# EAGLE design VentaConnected_Arduino_V0.01_2017-10-27 (EAGLE 8.3.2)
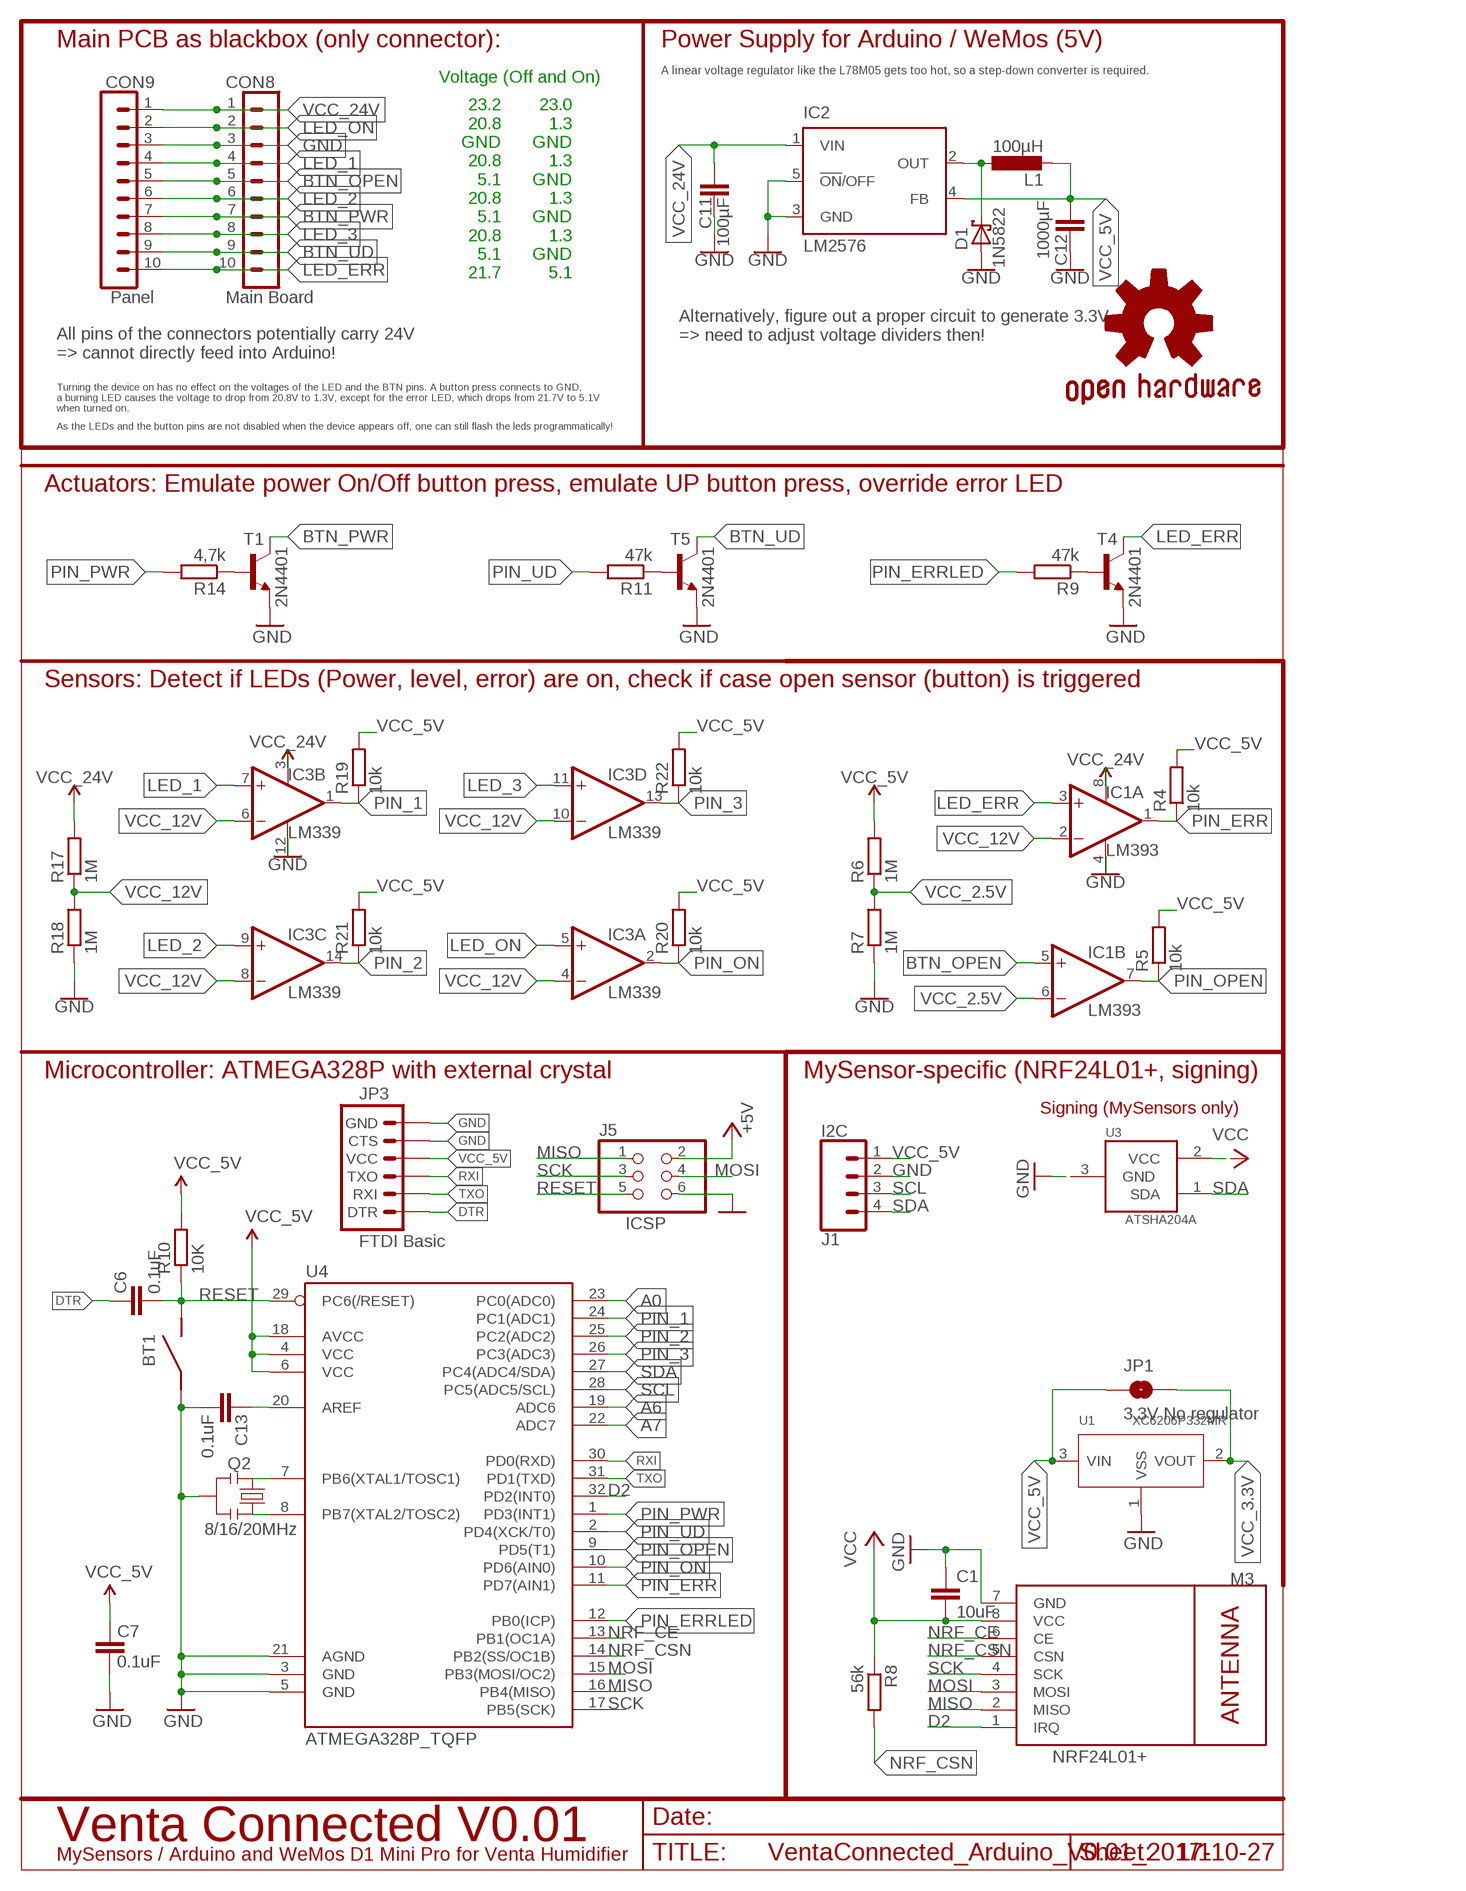
[diagram p0: schematic, sheet 1]

## Parts
BT1  SWITCHPROMINI_RESET  [SWITCH_SMD_PROMINI_RESET]
C1  10uF  C-EUC0805  [C0805]
C6  0.1uF  CAP0603-CAP  [0603-CAP]
C7  0.1uF  CAP0603-CAP  [0603-CAP]
C11  100µF  C-EUC0805  [C0805]
C12  1000µF  C-EUC0805  [C0805]
C13  0.1uF  CAP0603-CAP  [0603-CAP]
CON8  Main Board  CONN_05X2PTH  [2X5]
CON9  Panel  CONN_05X2SHD  [2X5-SHROUDED]
D1  1N5822  SCHOTTKY-DIODESMD  [SMB]
GOLD_ORB_SM1  OSHWLOGO_GOLD_ORB_SM  [OSHW2]
IC1  LM393  LM393D  [SO08]
IC2  LM2576  LM2596S  [TO263-5]
IC3  LM339  TLC339D  [SO14]
J1  I2C  CONN_04  [1X04]
J5  PINHD-2X3  [2X03]
JP1  3.3V No regulator  JUMPER-SMT_2_NO_SILK  [SMT-JUMPER_2_NO_SILK]
JP3  FTDI Basic  ARDUINO_SERIAL_PROGRAMPTH  [1X06]
L1  100µH  L-EUWE-TPC  [POWER-CHOKE_WE-TPC]
M3  NRF24L01+  WIRELESS-NRF24L01SMD  [WIRELESS-NRF24L01-SMD]
Q2  8/16/20MHz  RESONATOR1:1  [RESONATOR-SMD-1:1]
R4  10k  R-EU_R0805  [R0805]
R5  10k  R-EU_R0805  [R0805]
R6  1M  R-EU_R0805  [R0805]
R7  1M  R-EU_R0805  [R0805]
R8  56k  R-EU_R0805  [R0805]
R9  47k  R-EU_R0805  [R0805]
R10  10K  R-EU_R0805  [R0805]
R11  47k  R-EU_R0805  [R0805]
R14  4,7k  R-EU_R0805  [R0805]
R17  1M  R-EU_R0805  [R0805]
R18  1M  R-EU_R0805  [R0805]
R19  10k  R-EU_R0805  [R0805]
R20  10k  R-EU_R0805  [R0805]
R21  10k  R-EU_R0805  [R0805]
R22  10k  R-EU_R0805  [R0805]
T1  2N4401  MMBT4401LT1-NPN-SOT23-BEC  [SOT23-BEC]
T4  2N4401  MMBT4401LT1-NPN-SOT23-BEC  [SOT23-BEC]
T5  2N4401  MMBT4401LT1-NPN-SOT23-BEC  [SOT23-BEC]
U1  XC6206P332MR  PMIC-LDO-XC6206P332MR-G(SOT23)  [SOT-23]
U3  ATSHA204A  IC_ATSHA204A_CRYPT  [SOT23-3]
U4  ATMEGA328P_TQFP  [TQFP32-08]

## Nets
A0: U4.23(PC0(ADC0))
A6: U4.19(ADC6)
A7: U4.22(ADC7)
AREF: C13.2 U4.20(AREF)
BTN_OPEN: CON8.5 CON9.5 IC1.5(B:+IN)
BTN_PWR: CON8.7 CON9.7 T1.C
BTN_UD: CON8.9 CON9.9 T5.C
D2: M3.1(IRQ) U4.32(PD2(INT0))
DTR: C6.2 JP3.1(DTR)
GND: BT1.IN C7.1 C11.2 C12.2 C13.1 CON8.3 CON9.3 D1.A IC1.4(P:V-) IC2.3(GND) IC2.5(!ON!/OFF) IC3.12(P:V-) J1.2 J5.6 JP3.5(CTS) JP3.6(GND) Q2.2 R7.1 R18.1 T1.E T4.E T5.E U4.3(GND) U4.5(GND) U4.21(AGND)
GND_ARD: C1.1 M3.7(GND) U3.3(GND) ; supply symbol labelled GND
LED_1: CON8.4 CON9.4 IC3.7(B:+IN)
LED_2: CON8.6 CON9.6 IC3.9(C:+IN)
LED_3: CON8.8 CON9.8 IC3.11(D:+IN)
LED_ERR: CON8.10 CON9.10 IC1.3(A:+IN) T4.C
LED_ON: CON8.2 CON9.2 IC3.5(A:+IN)
MISO: J5.1 M3.2(MISO) U4.16(PB4(MISO))
MOSI: J5.4 M3.3(MOSI) U4.15(PB3(MOSI/OC2))
N$1: D1.C IC2.2(OUT) L1.1
N$2: R14.1 T1.B
N$5: R9.1 T4.B
N$6: R11.1 T5.B
N$12: Q2.3 U4.8(PB7(XTAL2/TOSC2))
N$13: Q2.1 U4.7(PB6(XTAL1/TOSC1))
NRF_CE: M3.6(CE) U4.13(PB1(OC1A))
NRF_CSN: M3.5(CSN) R8.2 U4.14(PB2(SS/OC1B))
PIN_1: IC3.1(B:OUT) R19.1 U4.24(PC1(ADC1))
PIN_2: IC3.14(C:OUT) R21.1 U4.25(PC2(ADC2))
PIN_3: IC3.13(D:OUT) R22.1 U4.26(PC3(ADC3))
PIN_ERR: IC1.1(A:OUT) R4.1 U4.11(PD7(AIN1))
PIN_ERRLED: R9.2 U4.12(PB0(ICP))
PIN_ON: IC3.2(A:OUT) R20.1 U4.10(PD6(AIN0))
PIN_OPEN: IC1.7(B:OUT) R5.1 U4.9(PD5(T1))
PIN_PWR: R14.2 U4.1(PD3(INT1))
PIN_UD: R11.2 U4.2(PD4(XCK/T0))
RESET: BT1.OUT C6.1 J5.5 R10.1 U4.29(PC6(/RESET))
RXI: JP3.3(TXO) U4.30(PD0(RXD))
SCK: J5.3 M3.4(SCK) U4.17(PB5(SCK))
SCL: J1.3 U4.28(PC5(ADC5/SCL))
SDA: J1.4 U3.1(SDA) U4.27(PC4(ADC4/SDA))
TXO: JP3.2(RXI) U4.31(PD1(TXD))
VCC_2.5V: IC1.6(B:-IN) R6.1 R7.2
VCC_3.3V: C1.2 JP1.2 M3.8(VCC) R8.1 U1.2(VOUT) ; supply symbol labelled VCC
VCC_5V: C7.2 C12.1 IC2.4(FB) J1.1 J5.2 JP1.1 JP3.4(VCC) L1.2 R4.2 R5.2 R6.2 R10.2 R19.2 R20.2 R21.2 R22.2 U1.3(VIN) U3.2(VCC) U4.4(VCC) U4.6(VCC) U4.18(AVCC) ; supply symbol labelled VCC, +5V
VCC_12V: IC1.2(A:-IN) IC3.4(A:-IN) IC3.6(B:-IN) IC3.8(C:-IN) IC3.10(D:-IN) R17.1 R18.2
VCC_24V: C11.1 CON8.1 CON9.1 IC1.8(P:V+) IC2.1(VIN) IC3.3(P:V+) R17.2
VSS: U1.1(VSS) ; supply symbol labelled GND

## Notes on the sheet
- Main PCB as blackbox (only connector): | Power Supply for Arduino / WeMos (5V)
- A linear voltage regulator like the L78M05 gets too hot, so a step-down converter is required.
- Voltage (Off and On)
- 23.2
  20.8
  GND
  20.8
  5.1
  20.8
  5.1
  20.8
  5.1
  21.7
- 23.0
  1.3
  GND
  1.3
  GND
  1.3
  GND
  1.3
  GND
  5.1
- Alternatively, figure out a proper circuit to generate 3.3V 
  => need to adjust voltage dividers then!
- All pins of the connectors potentially carry 24V 
  => cannot directly feed into Arduino!
- Turning the device on has no effect on the voltages of the LED and the BTN pins. A button press connects to GND, 
  a burning LED causes the voltage to drop from 20.8V to 1.3V, except for the error LED, which drops from 21.7V to 5.1V 
  when turned on.
- As the LEDs and the button pins are not disabled when the device appears off, one can still flash the leds programmatically!
- Actuators: Emulate power On/Off button press, emulate UP button press, override error LED
- Sensors: Detect if LEDs (Power, level, error) are on, check if case open sensor (button) is triggered
- Microcontroller: ATMEGA328P with external crystal | MySensor-specific (NRF24L01+, signing)
- Signing (MySensors only)
- ICSP
- Venta Connected V0.01
- MySensors / Arduino and WeMos D1 Mini Pro for Venta Humidifier

## Library data of the parts
BT1 = NCA_Sensors:SWITCH
C1 C11 C12 = rcl:C-EU: CAPACITOR, European symbol
C6 C7 C13 = SparkFun:CAP: Capacitor Standard 0603 ceramic capacitor, and 0.1" leaded capacitor.
CON8 = opentools-connectors:CONN_05X2: Multi connection point. Often used as Generic Header-pin footprint for 0.1 inch spaced/style header connections For AVR SPI programming port, see special device with nice symbol: "AVR_SPI_PROG_5x2.dev" You can populate with any combo of single row headers, but if you'd like an exact match, check these: 2x5 AVR ICSP Male Header <https://www.sparkfun.com/products/778> (PRT-00778) 2x5 Pin Shrouded Header <https://www.sparkfun.com/products/8506> (PRT-08506) On any of the 0.1 inch spaced packages, you can populate with these: Break Away Headers - Straight <https://www.sparkfun.com/products/116> (PRT-00116) Break Away Male Headers - Right Angle <https://www.sparkfun.com/products/553> (PRT-00553) Female Headers <https://www.sparkfun.com/products/115> (PRT-00115) Break Away Headers - Machine Pin <https://www.sparkfun.com/products/117> (PRT-00117) Break Away Female Headers - Swiss Machine Pin <https://www.sparkfun.com/products/743> (PRT-00743) Special note: the shrouded connector mates well with our 5x2 ribbon cables: 2x5 Pin IDC Ribbon Cable <https://www.sparkfun.com/products/8535> (PRT-08535); PROD_ID: CONN-08499; SF_ID: PRT-0778
CON9 = opentools-connectors:CONN_05X2: Multi connection point. Often used as Generic Header-pin footprint for 0.1 inch spaced/style header connections For AVR SPI programming port, see special device with nice symbol: "AVR_SPI_PROG_5x2.dev" You can populate with any combo of single row headers, but if you'd like an exact match, check these: 2x5 AVR ICSP Male Header <https://www.sparkfun.com/products/778> (PRT-00778) 2x5 Pin Shrouded Header <https://www.sparkfun.com/products/8506> (PRT-08506) On any of the 0.1 inch spaced packages, you can populate with these: Break Away Headers - Straight <https://www.sparkfun.com/products/116> (PRT-00116) Break Away Male Headers - Right Angle <https://www.sparkfun.com/products/553> (PRT-00553) Female Headers <https://www.sparkfun.com/products/115> (PRT-00115) Break Away Headers - Machine Pin <https://www.sparkfun.com/products/117> (PRT-00117) Break Away Female Headers - Swiss Machine Pin <https://www.sparkfun.com/products/743> (PRT-00743) Special note: the shrouded connector mates well with our 5x2 ribbon cables: 2x5 Pin IDC Ribbon Cable <https://www.sparkfun.com/products/8535> (PRT-08535); PROD_ID: CONN-08671; SF_ID: PRT-08506
D1 = diode:SCHOTTKY-DIODE: Schottky Diode
GOLD_ORB_SM1 = bfl:OSHWLOGO: These are Open-Source Hardware logos.
IC1 = linear:LM393: COMPARATOR
IC2 = national-semiconductor:LM2596: SIMPLE SWITCHER® Power Converter 150 kHz 3A Step-Down Voltage Regulator Source: http://www.national.com/ds/LM/LM2596.pdf; MF: NATIONAL SEMICONDUCTOR; MPN: LM2596S-ADJ/NOPB; OC_FARNELL: 9494367; OC_NEWARK: 41K3842
IC3 = linear:TLC339: COMPARATOR
J1 = SparkFun-Connectors:CONN_04: Multi connection point. Often used as Generic Header-pin footprint for 0.1 inch spaced/style header connections On any of the 0.1 inch spaced packages, you can populate with these: Break Away Headers - Straight <https://www.sparkfun.com/products/116> (PRT-00116) Break Away Male Headers - Right Angle <https://www.sparkfun.com/products/553> (PRT-00553) Female Headers <https://www.sparkfun.com/products/115> (PRT-00115) Break Away Headers - Machine Pin <https://www.sparkfun.com/products/117> (PRT-00117) Break Away Female Headers - Swiss Machine Pin <https://www.sparkfun.com/products/743> (PRT-00743) For SCREWTERMINALS and SPRING TERMINALS visit here: Screw Terimnals on SparkFun.com <https://www.sparkfun.com/search/results?term=Screw+Terminals> (5mm/3.5mm/2.54mm spacing) This device is also useful as a general connection point to wire up your design to another part of your project. Our various solder wires solder well into these plated through hole pads. Hook-Up Wire - Assortment (Stranded, 22 AWG) <https://www.sparkfun.com/products/11375> (PRT-11375) Hook-Up Wire - Assortment (Solid Core, 22 AWG) <https://www.sparkfun.com/products/11367> (PRT-11367) View the entire wire category on our website here <https://www.sparkfun.com/categories/141> Special notes: Molex polarized connector foot print use with SKU : PRT-08231 with associated crimp pins and housings. 1MM SMD Version SKU: PRT-10208; PROD_ID: CONN-09696
J5 = analyzer:PINHD-2X3
JP1 = SparkFun-Jumpers:JUMPER-SMT_2_NO: Normally open jumper This jumper has two pads in close proximity to each other. Apply solder to close the connection. Round pads are easier to solder for beginners, but are a lot larger. SparkFun Product that uses the round pads: SparkFun EL Sequencer <https://www.sparkfun.com/products/12781>
JP3 = SparkFun:ARDUINO_SERIAL_PROGRAM
L1 = rcl:L-EU: INDUCTOR, European symbol
M3 = nrf24l01plus:WIRELESS-NRF24L01: 2.4 GHz Wireless Module based on NRF24L01 chip
Q2 = Testing:RESONATOR: Resonator Small SMD resonator. This is the itty bitty 10/20MHz resonators with built in caps. CSTCE10M0G55 and CSTCE20M0V53. Footprint for SMD has been used in SFE production for years, and does work okay. 1:1 is an attempt to get larger fillets on the sides so it will be easier to inspect these solders in our AOI machine. The pads have been minimized to match the actual metal under the resonator. To see this relation, it includes an image import of the bottom side of the component. Imported to scale on layer 200.
R4 R5 R8 R10 R19-R22 = rcl:R-EU_: RESISTOR, European symbol
R6 R7 R9 R11 R14 R17 R18 = resistor:R-EU_: RESISTOR, European symbol
T1 T4 T5 = transistor-neu-to92:*-NPN-: NPN Transistror
U1 = Seeed-IC:PMIC-LDO-XC6206P332MR-G(SOT23): 310030099; MPN: XC6206P332MR-G; VALUE: XC6206P332MR-G-SOT23
U3 = TD-MySensors:IC_ATSHA204A_CRYPT
U4 = SparkFun-IC-Microcontroller:ATMEGA328P_TQFP: Popular 328P in QFP Storefront component: ATmega328 - TQFP <https://www.sparkfun.com/products/13448> (COM-13448) Datasheet <http://www.sparkfun.com/datasheets/Components/SMD/ATMega328.pdf> SparkFun Products SparkFun RedBoard - Programmed with Arduino <https://www.sparkfun.com/products/12757> (DEV-12757) Arduino Pro Mini 328 - 5V/16MHz <https://www.sparkfun.com/products/11113> (DEV-11113) Arduino Pro Mini 328 - 3.3V/8MHz <https://www.sparkfun.com/products/11114> (DEV-11114) SparkFun OpenLog <https://www.sparkfun.com/products/13712> (DEV-13712) SparkFun MicroView - OLED Arduino Module <https://www.sparkfun.com/products/12923> (DEV-12923) SparkFun Digital Sandbox <https://www.sparkfun.com/products/12651> (DEV-12651) SparkFun PicoBoard <https://www.sparkfun.com/products/11888> (WIG-11888) Arduino Fio <https://www.sparkfun.com/products/10116> (DEV-10116) LilyPad Arduino 328 Main Board <https://www.sparkfun.com/products/13342> (DEV-13342) SparkFun RedStick <https://www.sparkfun.com/products/13741> (DEV-13741) LilyPad MP3 <https://www.sparkfun.com/products/11013> (DEV-11013) LilyPad Arduino SimpleSnap <https://www.sparkfun.com/products/10941> (DEV-10941) SparkFun Stepoko <https://www.sparkfun.com/products/13899> (ROB-13899) SparkFun Geiger Counter <https://www.sparkfun.com/products/11345> (SEN-11345) SparkFun EL Sequencer <https://www.sparkfun.com/products/12781> (COM-12781) Arduino Pro 328 - 5V/16MHz <https://www.sparkfun.com/products/10915> (DEV-10915) CryptoCape <https://www.sparkfun.com/products/12773> (DEV-12773) SparkFun IR Thermometer Evaluation Board - MLX90614 <https://www.sparkfun.com/products/10740> (SEN-10740) SparkFun RedBot Mainboard <https://www.sparkfun.com/products/12097> (ROB-12097) Arduino Pro 328 - 3.3V/8MHz <https://www.sparkfun.com/products/10914> (DEV-10914) SparkFun Block for Intel® Edison - Arduino <https://www.sparkfun.com/products/13036> (DEV-13036) SparkFun Simon Says - Surface Mount Soldering Kit <https://www.sparkfun.com/products/10935> (KIT-10935) SparkFun 7-Segment Serial Display - Red <https://www.sparkfun.com/products/11441> (COM-11441) SparkFun 7-Segment Serial Display - White <https://www.sparkfun.com/products/11629> (COM-11629) SparkFun 7-Segment Serial Display - Yellow <https://www.sparkfun.com/products/11443> (COM-11443) SparkFun 7-Segment Serial Display - Kelly Green <https://www.sparkfun.com/products/11440> (COM-11440) SparkFun 7-Segment Serial Display - Blue <https://www.sparkfun.com/products/11442> (COM-11442) SparkFun OpenSegment Serial Display - 20mm (Blue) <https://www.sparkfun.com/products/11647> (COM-11647) SparkFun OpenSegment Serial Display - 20mm (Green) <https://www.sparkfun.com/products/11646> (COM-11646) SparkFun OpenSegment Serial Display - 20mm (White) <https://www.sparkfun.com/products/11648> (COM-11648) SparkFun OpenSegment Serial Display - 20mm (Red) <https://www.sparkfun.com/products/11644> (COM-11644) SparkFun OpenSegment Serial Display - 20mm (Yellow) <https://www.sparkfun.com/products/11645> (COM-11645) SparkFun OpenSegment Shield <https://www.sparkfun.com/products/13190> (DEV-13190); PROD_ID: IC-09069

## Net classes
0 default: width 0.203 mm
1 vcc: width 0.254 mm

## Board
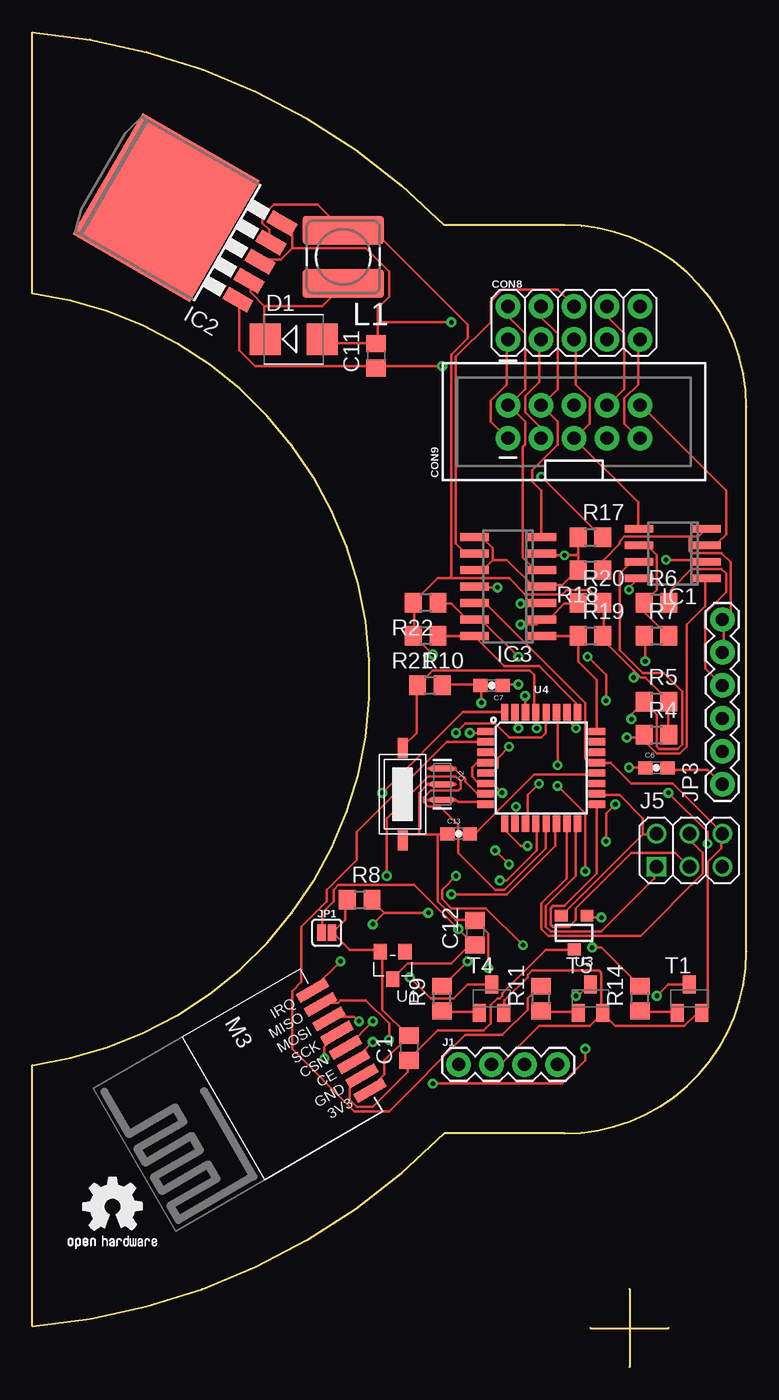
[diagram p1: board, top side]
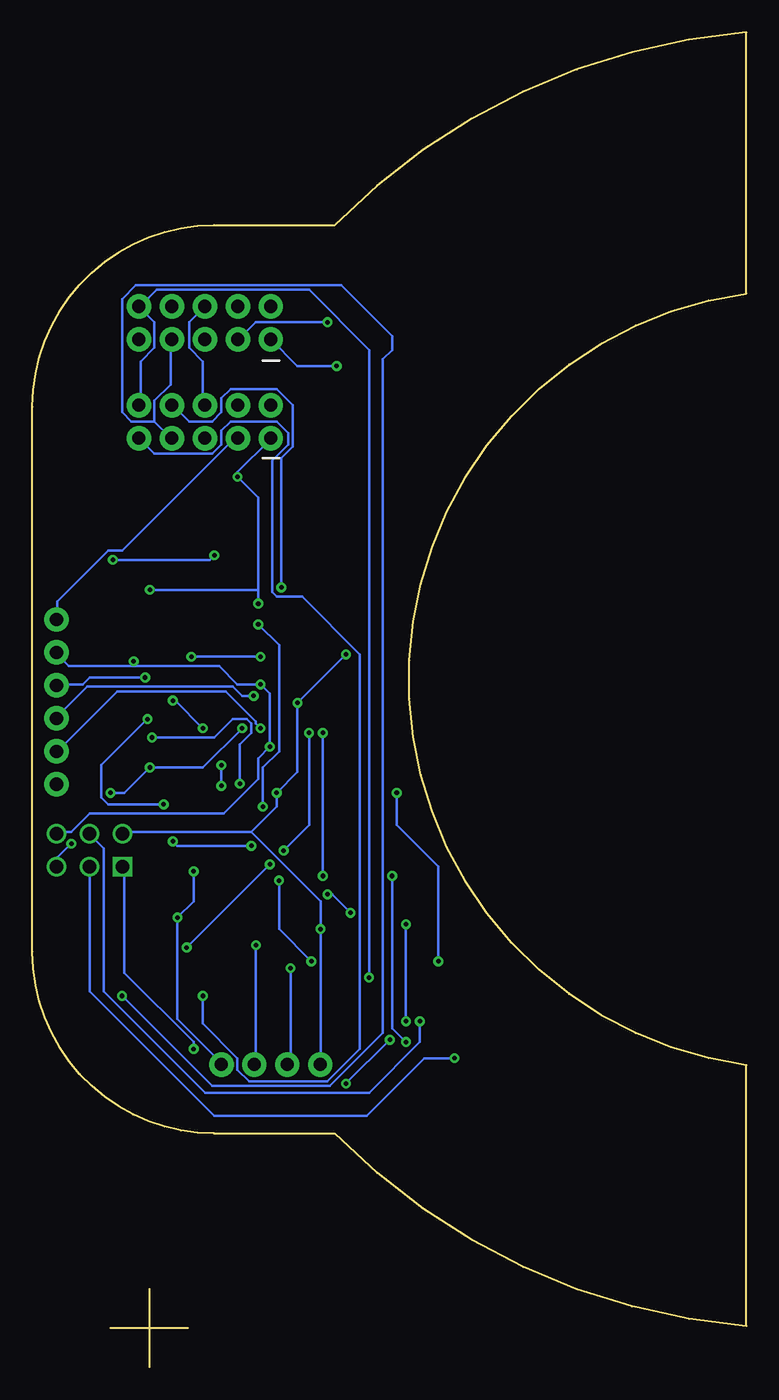
[diagram p2: board, bottom side, seen from below]

Size 55 x 102.85 mm. Coordinates in mm from the lower left corner, seen from the top.
Outline: 46,6 46,0
Outline: 43,3 49,3
Outline: 41,18 arc90 55,32 55,74 arc90 41,88 31.71,88 arc41 0,102.85 0,82.73 arc-165 0,23.27 0,3.16 arc41 31.71,18 41,18
Copper layers (1*16): Top 0.035mm / dielectric 1.5mm / Bottom 0.035mm
Design rules "default": minimum track width 6mil, minimum drill 0.35mm, track to track 6mil, track to pad 6mil, pad to pad 6mil, via to via 6mil, smd to smd 6mil, copper to edge 40mil, drill to drill 6mil, minimum pad ring 10mil, minimum via ring 8mil, stop-mask expansion 4mil, vias tented up to drill 0mil, thermal gap 10mil

### Footprints (pad centres in the part's own frame; a part is rotated, then mirrored left to right if it is on the bottom)
SWITCH_SMD_PROMINI_RESET = smd 1.524 x 0.762: IN -0.508,1.778; OUT 6.604,1.778
C0805 = smd 1.3 x 1.5: 1 -0.95,0; 2 0.95,0
0603-CAP = smd 1.1 x 1: 1 -0.85,0; 2 0.85,0
2X5 = drill 1.016 pad 1.88: 1 0,0; 2 0,2.54; 3 2.54,0; 4 2.54,2.54; 5 5.08,0; 6 5.08,2.54; 7 7.62,0; 8 7.62,2.54; 9 10.16,0; 10 10.16,2.54
2X5-SHROUDED = drill 1.016 pad 1.88: 1 -1.27,5.08; 2 1.27,5.08; 3 -1.27,2.54; 4 1.27,2.54; 5 -1.27,0; 6 1.27,0; 7 -1.27,-2.54; 8 1.27,-2.54; 9 -1.27,-5.08; 10 1.27,-5.08
SMB = smd 2.4 x 2.4: A 2.2,0; C -2.2,0
SO08 = smd 0.6 x 2.2: 1 -1.905,-2.6; 2 -0.635,-2.6; 3 0.635,-2.6; 4 1.905,-2.6; 5 1.905,2.6; 6 0.635,2.6; 7 -0.635,2.6; 8 -1.905,2.6
TO263-5 = smd 1.067 x 2.159: 1 -3.404,-5.791; 2 -1.702,-5.791; 3 0,-5.791; 4 1.702,-5.791; 5 3.404,-5.791 | smd 10.8 x 10.41: 6 0,2.54
SO14 = smd 0.6 x 2.2: 1 -3.81,-2.6; 2 -2.54,-2.6; 3 -1.27,-2.6; 4 0,-2.6; 5 1.27,-2.6; 6 2.54,-2.6; 7 3.81,-2.6; 8 3.81,2.6; 9 2.54,2.6; 10 1.27,2.6; 11 0,2.6; 12 -1.27,2.6; 13 -2.54,2.6; 14 -3.81,2.6
1X04 = drill 1.016 pad 1.88: 1 0,0; 2 2.54,0; 3 5.08,0; 4 7.62,0
2X03 = drill 1.016 square: 1 -2.54,-1.27 | drill 1.016: 2 -2.54,1.27; 3 0,-1.27; 4 0,1.27; 5 2.54,-1.27; 6 2.54,1.27
SMT-JUMPER_2_NO_SILK = smd 0.635 x 1.27: 1 -0.406,0; 2 0.406,0
1X06 = drill 1.016 pad 1.88: 1 0,0; 2 2.54,0; 3 5.08,0; 4 7.62,0; 5 10.16,0; 6 12.7,0
POWER-CHOKE_WE-TPC = smd 6.3 x 2.2: 1 0,2.05; 2 0,-2.05
WIRELESS-NRF24L01-SMD = smd 2.54 x 0.762: 1 1.27,0; 2 1.27,1.27; 3 1.27,2.54; 4 1.27,3.81; 5 1.27,5.08; 6 1.27,6.35; 7 1.27,7.62; 8 1.27,8.89
RESONATOR-SMD-1:1 = smd 0.45 x 1.905: 1 -1.2,0; 2 0,0; 3 1.2,0
R0805 = smd 1.3 x 1.5: 1 -0.95,0; 2 0.95,0
SOT23-BEC = smd 1 x 1.4: B -0.95,-1.1; C 0,1.1; E 0.95,-1.1
SOT-23 = smd 1.016 x 1.2: 1 -0.95,-1.06; 2 0.95,-1.06; 3 0,1.06
SOT23-3 = smd 1 x 0.9: 1 -1,-1.3; 2 1,-1.3; 3 0,1.3
TQFP32-08 = smd 1.27 x 0.559: 1 -4.293,2.8; 2 -4.293,2; 3 -4.293,1.2; 4 -4.293,0.4; 5 -4.293,-0.4; 6 -4.293,-1.2; 7 -4.293,-2; 8 -4.293,-2.8; 17 4.293,-2.8; 18 4.293,-2; 19 4.293,-1.2; 20 4.293,-0.4; 21 4.293,0.4; 22 4.293,1.2; 23 4.293,2; 24 4.293,2.8 | smd 0.559 x 1.27: 9 -2.8,-4.293; 10 -2,-4.293; 11 -1.2,-4.293; 12 -0.4,-4.293; 13 0.4,-4.293; 14 1.2,-4.293; 15 2,-4.293; 16 2.8,-4.293; 25 2.8,4.293; 26 2,4.293; 27 1.2,4.293; 28 0.4,4.293; 29 -0.4,4.293; 30 -1.2,4.293; 31 -2,4.293; 32 -2.8,4.293

### Placement (x,y rotation side)
BT1  30.29,41.1 90 top
C1  29.02,24.59 90 top
C6  48.07,46.18 0 top
C7  35.37,52.53 180 top
C11  26.48,77.93 90 top
C12  34.1,33.48 90 top
C13  32.83,41.1 0 top
CON8  36.64,79.2 0 top
CON9  41.72,72.85 90 top
D1  20.13,79.2 0 top
GOLD_ORB_SM1  2.35,8.08 0 top
IC1  49.34,62.69 90 top
IC2  12.51,88.09 60 top
IC3  36.64,60.15 90 top
J1  32.83,23.32 0 top
J5  50.61,39.83 0 top
JP1  22.67,33.48 0 top
JP3  53.15,44.91 90 top
L1  23.94,85.55 180 top
M3  22.67,29.67 210 top
Q2  31.56,44.91 270 top
R4  48.07,48.72 0 top
R5  48.07,51.26 0 top
R6  48.07,58.88 0 top
R7  48.07,56.34 0 top
R8  25.21,36.02 0 top
R9  31.56,28.4 90 top
R10  30.61,52.53 0 top
R11  39.18,28.4 90 top
R14  46.8,28.4 90 top
R17  42.99,63.96 0 top
R18  42.99,61.42 180 top
R19  42.99,56.34 0 top
R20  42.99,58.88 0 top
R21  30.29,56.34 180 top
R22  30.29,58.88 180 top
T1  50.61,28.4 0 top
T4  35.37,28.4 0 top
T5  42.99,28.4 0 top
U1  27.75,30.94 180 top
U3  41.72,33.48 180 top
U4  39.18,46.18 0 top

### Tracks (layer width: path | path; a pad name or v marks a point on that pad's centre or on a via)
AREF
  Top 0.203: C13.2 33.69,41.23 34.23,41.23 38.67,45.67 43.47,45.67 U4.20
BTN_OPEN
  Top 0.203: IC1.5 46.67,64.7 46.67,66.65 41.87,71.45 CON9.5 41.87,71.63 42.94,72.7 42.94,74.65 41.87,75.72 41.87,79.1 CON8.5
BTN_PWR  (via drill 0.35)
  Top 0.203: v48.09,28.6 48.98,29.49 50.59,29.49 T1.C
  Bottom 0.203: v48.09,28.6 41.16,21.67 32.09,21.67 28,25.76 28,77.68 27.29,78.39 27.29,79.45 31.2,83.37 47.03,83.37 48.09,82.3 48.09,73.59 47.38,72.88 45.61,72.88 | 45.61,72.88 44.36,71.63 CON9.7 | 45.61,72.88 45.61,74.48 44.36,75.72 44.36,79.1 CON8.7
BTN_UD  (via drill 0.35)
  Top 0.203: v41.87,28.6 42.05,28.6 42.94,29.49 T5.C | CON8.9 46.67,79.1 46.67,75.72 45.61,74.65 45.61,72.7 46.67,71.63 CON9.9
  Bottom 0.203: v41.87,28.6 41.87,26.47 39.2,23.8 39.2,22.91 38.32,22.02 32.27,22.02 29.78,24.51 29.78,54.92 34.23,59.36 36.18,59.36 36.54,59.72 36.54,69.85 35.29,71.1 35.29,71.99 36.18,72.88 39.74,72.88 40.45,72.16 40.45,71.1 41.16,70.39 45.61,70.39 CON9.9
D2  (via drill 0.35)
  Top 0.203: U4.32 33.16,50.47 v26.94,44.25 | v23.74,31.27 21.6,29.14 M3.1
  Bottom 0.203: v26.94,44.25 26.94,41.76 23.74,38.56 v23.74,31.27
DTR
  Top 0.203: C6.2 48.98,46.03 52.01,46.03 53.07,44.96 JP3.1
GND  (via drill 0.35)
  Top 0.203: IC3.12 34.05,58.83 34.94,58.83 42.58,51.18 42.58,46.92 42.76,46.74 43.47,46.74 U4.21 43.47,46.56 44.54,46.56 46.14,44.96 49.34,44.96 53.07,41.23 J5.6 53.07,41.05 53.07,39.98 52.01,38.92 52.01,27.71 51.65,27.36 T1.E 51.47,27.18 51.12,27.18 50.23,26.29 44.9,26.29 44.01,27.18 T5.E | 29.78,41.05 28.89,41.05 28.54,40.69 BT1.IN | 29.78,41.05 31.2,41.05 | 31.2,41.05 31.92,41.05 C13.1 | 31.2,41.05 31.2,35.89 32.63,34.47 34.05,34.47 C12.2 34.23,34.29 35.12,33.4 v35.12,30.74 | 29.78,41.05 29.78,44.25 30.49,44.96 30.54,44.91 | T4.E 36.36,27.36 36.36,28.25 38.14,30.03 38.14,30.2 38.49,30.56 43.65,30.56 43.83,30.38 43.83,27.36 T5.E | J1.2 35.47,23.45 36.18,23.45 39.03,26.29 42.94,26.29 43.83,27.18 T5.E | D1.A 22.49,79.1 22.67,78.92 26.4,78.92 C11.2 26.58,78.92 26.58,80.52 | 20,86.21 19.11,85.32 17.69,85.32 IC2.3 | 20,86.21 20,87.28 19.29,87.99 IC2.5 | 26.58,80.52 26.58,81.59 27.47,82.48 27.47,84.43 25.69,86.21 20,86.21 | CON9.3 39.03,71.63 39.03,72.52 37.96,73.59 37.96,74.83 39.03,75.9 39.03,79.1 CON8.3 | 50.59,63.98 51.3,63.98 51.83,64.52 IC1.4 | 50.59,63.98 45.61,63.98 45.25,63.63 45.25,63.45 44.01,62.21 44.01,61.5 R18.1 | 35.83,46.92 35.83,46.2 35.47,45.85 34.94,45.85 U4.5 | 35.83,46.92 35.47,47.27 34.94,47.27 U4.3 | v37.43,52.61 36.36,52.61 C7.1 | v47.21,54.38 47.21,56.34 R7.1 | v36.72,47.81 35.83,46.92 | JP3.5 53.25,55.09 53.25,57.59 JP3.6 53.25,57.76 53.78,58.3 53.78,62.03 53.07,62.74 50.76,62.74 50.59,62.92 50.59,63.98 | v32.27,80.52 26.58,80.52
  Bottom 0.203: v35.12,30.74 35.12,23.62 35.29,23.45 J1.2 | 47.21,54.03 52.19,54.03 53.07,54.92 JP3.5 | 47.21,54.03 40.63,54.03 39.2,52.61 v37.43,52.61 36.72,51.9 v36.72,47.81 37.6,46.92 37.6,45.32 40.27,42.65 50.59,42.65 52.01,41.23 53.07,41.23 J5.6 | 47.21,54.03 v47.21,54.38 | CON9.3 39.2,71.45 39.56,71.45 48.09,62.92 49.16,62.92 53.07,59.01 53.07,57.76 JP3.6 | v32.27,80.52 37.78,80.52 39.03,79.28 CON8.3
GND_ARD
  Top 0.203: U3.3 41.7,32.16 39.56,32.16 36.18,28.78 36.18,28.6 36.01,28.43 35.83,28.43 35.29,27.89 35.29,26.47 34.76,25.94 31.2,25.94 29.07,23.8 C1.1 28.89,23.62 28.89,22.74 26.23,20.07 24.98,20.07 24.45,20.6 24.45,21.49 25.34,22.38 M3.7
LED_1
  Top 0.203: 39.2,74.12 40.45,72.88 40.45,71.1 38.49,69.14 38.49,68.25 39.2,67.54 39.2,63.98 IC3.7 | 39.2,74.12 40.45,75.36 40.45,79.63 39.2,80.88 39.2,81.59 CON8.4 | 39.2,74.12 CON9.4
LED_2
  Top 0.203: CON8.6 40.45,83.01 36.18,83.01 35.29,82.12 35.29,80.52 32.63,77.85 32.63,63.45 33.34,62.74 33.87,62.74 IC3.9
  Bottom 0.203: CON8.6 42.94,80.52 42.94,78.56 41.87,77.5 41.87,74.12 CON9.6
LED_3  (via drill 0.35)
  Top 0.203: v35.83,60.07 34.05,60.07 IC3.11 | CON8.8 44.36,81.59 44.36,80.88 45.61,79.63 45.61,75.36 44.36,74.12 CON9.8
  Bottom 0.203: v35.83,60.07 35.83,70.03 34.94,70.92 34.94,74.12 36.18,75.36 39.74,75.36 40.45,74.65 40.45,73.59 41.16,72.88 42.94,72.88 44.18,74.12 CON9.8
LED_ERR  (via drill 0.35)
  Top 0.203: IC1.3 52.01,63.45 52.72,63.45 53.43,64.16 53.43,67.54 46.85,74.12 CON9.10 | v29.07,30.03 30.67,28.43 32.45,28.43 33.52,29.49 35.29,29.49 T4.C
  Bottom 0.203: v29.07,30.03 29.07,78.39 33.69,83.01 45.43,83.01 46.67,81.77 CON8.10 46.67,81.59 45.61,80.52 45.61,78.56 46.67,77.5 46.67,74.12 CON9.10
LED_ON
  Top 0.203: 36.72,74.12 37.96,72.88 37.96,71.1 37.78,70.92 37.78,62.38 38.67,61.5 39.2,61.5 IC3.5 | 36.72,74.12 37.96,75.36 37.96,79.63 36.72,80.88 36.72,81.59 CON8.2 | 36.72,74.12 CON9.2
MISO  (via drill 0.35)
  Top 0.203: U4.16 41.87,41.76 41.87,37.85 39.56,35.54 39.56,33.94 39.92,33.58 43.83,33.58 47.92,37.67 47.92,38.56 J5.1 | v27.47,25.23 27.47,26.47 25.69,28.25 23.74,28.25 23.56,28.07 22.31,28.07 M3.2 | v30.85,21.85 40.81,21.85 42.58,23.62 v42.58,24.51
  Bottom 0.203: v30.85,21.85 v27.47,25.23 | v42.58,24.51 42.58,25.05 47.92,30.38 47.92,38.56 J5.1
MOSI  (via drill 0.35)
  Top 0.203: U4.15 41.16,41.76 41.16,37.67 39.2,35.72 39.2,33.76 39.74,33.23 46.85,33.23 51.65,38.03 51.65,39.63 50.76,40.52 50.76,41.05 J5.4 | v25.16,26.65 24.8,27 22.85,27 M3.3
  Bottom 0.203: v25.16,26.65 25.16,25.05 29.07,21.14 41.7,21.14 49.52,28.96 49.52,39.98 50.59,41.05 J5.4
N$1
  Top 0.203: 17.87,81.77 16.8,82.83 16.8,83.54 IC2.2 | 17.87,81.77 17.87,79.28 D1.C | 17.87,81.77 22.31,81.77 23.91,83.37 L1.1
N$2
  Top 0.203: T1.B 49.52,27.36 46.85,27.36 R14.1
N$5
  Top 0.203: T4.B 34.41,27.36 31.56,27.36 R9.1
N$6
  Top 0.203: T5.B 41.87,27.36 39.2,27.36 R11.1
N$12
  Top 0.203: U4.8 34.76,43.54 32.8,43.54 32.63,43.72 Q2.3
N$13
  Top 0.203: U4.7 34.76,44.25 34.23,44.25 33.34,45.14 33.34,45.32 32.63,46.03 Q2.1
NRF_CE  (via drill 0.35)
  Top 0.203: v27.29,37.85 27.29,42.29 30.49,45.49 32.63,45.49 32.98,45.14 32.98,44.6 32.8,44.43 30.67,44.43 30.14,43.89 30.14,43.54 30.49,43.18 31.38,43.18 32.8,41.76 32.8,39.63 35.65,36.78 36.36,36.78 39.56,39.98 39.56,41.76 U4.13 | v26.23,25.05 24.8,23.62 M3.6
  Bottom 0.203: v27.29,37.85 27.29,26.11 v26.23,25.05
NRF_CSN  (via drill 0.35)
  Top 0.152: 24.25,24.75 M3.5
  Top 0.203: v32.27,36.43 36.54,36.43 40.27,40.16 40.27,41.76 U4.14 | 27.11,35 v30.49,35 | 27.11,35 26.23,35.89 R8.2 | v26.23,26.65 24.27,24.69 M3.5 | 27.11,35 v26.23,34.11
  Bottom 0.203: v32.27,36.43 31.92,36.43 v30.49,35 | v26.23,34.11 v26.23,26.65
PIN_1
  Top 0.203: U4.24 43.47,52.96 42.05,54.38 R19.1 IC3.1
PIN_2
  Top 0.203: U4.25 41.87,50.47 41.87,51.18 39.03,54.03 36.36,54.03 IC3.14 R21.1
PIN_3  (via drill 0.35)
  Top 0.203: v41.87,49.23 41.34,49.76 41.34,50.47 U4.26 | v44.18,51.36 44.18,53.32 v42.76,54.74 | v37.43,54.74 34.58,57.59 34.05,57.59 IC3.13 33.87,57.76 33.34,57.76 32.27,58.83 31.38,58.83 R22.1
  Bottom 0.203: v41.87,49.23 44.01,51.36 v44.18,51.36 | v37.43,54.74 v42.76,54.74
PIN_ERR  (via drill 0.35)
  Top 0.203: v39.03,44.96 38.14,44.07 38.14,41.94 U4.11 | 46.85,48.52 v45.78,48.52 | 46.85,48.52 47.03,48.7 R4.1 46.85,48.52 | 46.85,48.52 48.09,47.27 49.87,47.27 50.41,47.81 50.41,57.23 51.83,58.65 51.83,60.78 IC1.1
  Bottom 0.203: v39.03,44.96 39.03,47.98 38.14,48.87 38.14,49.58 38.49,49.94 39.56,49.94 40.98,48.52 v45.78,48.52
PIN_ERRLED  (via drill 0.35)
  Top 0.203: v36.01,37.49 36.54,37.49 38.85,39.8 38.85,41.76 U4.12 | v33.52,31.27 31.56,29.31 R9.2
  Bottom 0.203: v36.01,37.49 36.01,33.76 v33.52,31.27
PIN_ON  (via drill 0.35)
  Top 0.203: v37.25,43.18 37.25,41.94 U4.10 | v37.6,57.23 38.85,57.23 39.2,57.59 IC3.2 39.38,57.76 39.92,57.76 40.98,58.83 41.87,58.83 R20.1
  Bottom 0.203: v37.25,43.18 37.25,46.2 36.01,47.45 36.01,55.63 v37.6,57.23
PIN_OPEN  (via drill 0.35)
  Top 0.203: v38.14,40.16 37.6,40.16 36.54,41.23 36.54,41.76 U4.9 | v44.18,40.52 44.18,42.65 v44.9,43.36 | v46.14,49.94 46.14,50.3 47.03,51.18 R5.1 47.21,51.18 48.09,50.3 48.09,47.81 48.27,47.63 49.7,47.63 50.05,47.98 50.05,52.07 48.63,53.49 47.03,53.49 45.25,55.27 45.25,61.14 46.14,62.03 46.67,62.03 IC1.7
  Bottom 0.203: v38.14,40.16 43.83,40.16 v44.18,40.52 | v44.9,43.36 49.16,43.36 49.7,43.89 49.7,46.38 v46.14,49.94
PIN_PWR  (via drill 0.35)
  Top 0.203: v33.69,48.87 34.76,48.87 U4.1 | v36.72,38.74 v35.65,39.8 | v43.12,32.34 43.83,32.34 46.67,29.49 R14.2
  Bottom 0.203: v33.69,48.87 33.69,41.76 v35.65,39.8 | v43.12,32.34 v36.72,38.74
PIN_UD
  Top 0.203: U4.2 34.76,48.16 31.92,48.16 24.98,41.23 24.98,39.09 22.67,36.78 22.67,35.89 20.71,33.94 20.71,29.67 20,28.96 20,24.51 24.8,19.71 27.47,19.71 33.34,25.58 36.18,25.58 38.14,27.54 38.14,28.43 39.03,29.31 R11.2
RESET  (via drill 0.35)
  Top 0.203: BT1.OUT 28.54,47.81 29.6,48.87 29.6,52.43 R10.1 29.78,52.61 30.85,53.67 38.32,53.67 38.67,53.32 38.67,50.47 U4.29 38.85,50.47 v38.85,49.23 | v45.96,46.2 47.21,46.2 C6.1 | v52.01,40.34 52.01,41.23 v48.98,44.25
  Bottom 0.203: v38.85,49.23 41.87,46.2 v45.96,46.2 47.92,44.25 v48.98,44.25 | v52.01,40.34 53.07,39.27 53.07,38.56 J5.5
RXI  (via drill 0.35)
  Top 0.203: v37.96,51.72 37.96,50.47 U4.30
  Bottom 0.203: v37.96,51.72 38.85,51.72 39.56,52.43 50.76,52.43 53.07,50.12 JP3.3
SCK  (via drill 0.35)
  Top 0.203: U4.17 43.47,38.03 40.98,35.54 40.09,35.54 39.92,35.36 39.92,34.11 40.09,33.94 41.34,33.94 41.87,34.47 41.87,35.36 46.14,39.63 49.52,39.63 50.59,38.56 J5.3 | v22.49,23.8 22.49,24.69 23.38,25.58 M3.4
  Bottom 0.203: v22.49,23.8 24.8,23.8 29.25,19.36 40.98,19.36 50.59,28.96 50.59,38.56 J5.3
SCL  (via drill 0.35)
  Top 0.203: v32.63,48.87 33.34,49.58 35.65,49.58 36.72,48.52 39.2,48.52 39.56,48.87 39.56,50.47 U4.28 | v32.63,37.85 31.56,36.78 31.56,36.07 32.27,35.36 34.94,35.36 v37.78,32.52
  Bottom 0.203: v32.63,37.85 v32.63,48.87 | v37.78,32.52 37.78,23.45 J1.3
SDA  (via drill 0.35)
  Top 0.203: v43.83,34.65 42.76,34.65 U3.1 | v40.45,46.38 40.45,50.47 U4.27 | v40.45,44.78 42.58,42.65 v42.58,38.2
  Bottom 0.203: J1.4 40.45,23.45 43.83,26.82 v43.83,34.65 42.58,35.89 v42.58,38.2 | v40.45,44.78 v40.45,46.38
TXO  (via drill 0.35)
  Top 0.203: v37.43,49.23 37.25,49.41 37.25,50.47 U4.31
  Bottom 0.203: v37.43,49.23 37.78,49.58 37.78,49.76 40.09,52.07 48.45,52.07 53.07,47.45 JP3.2
VCC_2.5V
  Top 0.203: R7.2 48.98,56.34 47.21,58.12 47.21,58.83 R6.1 47.21,59.01 48.09,59.9 48.09,62.56 47.38,63.27 46.85,63.27 IC1.6
VCC_3.3V
  Top 0.203: R8.1 24.09,35.89 24.09,34.47 23.2,33.58 JP1.2 23.2,33.4 24.45,32.16 26.76,32.16 U1.2 26.94,31.98 26.94,27.54 28.89,25.58 C1.2 28.89,25.4 27.11,23.62 27.11,22.56 26.05,21.49 M3.8
VCC_5V  (via drill 0.35)
  Top 0.203: 34.05,32.52 33.69,32.52 32.27,31.09 28.89,31.09 27.83,30.03 U1.3 | 34.05,32.52 v32.8,33.76 29.43,37.14 23.56,37.14 23.2,36.78 23.2,35.89 22.31,35 22.31,33.58 JP1.1 | 34.05,32.52 C12.1 | R10.2 31.56,52.61 34.41,52.61 C7.2 34.58,52.43 v34.58,51.18 | U4.4 34.76,46.56 34.23,46.56 33.87,46.2 33.87,45.49 34.23,45.14 34.76,45.14 U4.6 34.94,44.96 35.47,44.96 v36.18,44.25 | 47.03,41.05 40.81,34.83 U3.2 | 47.03,41.05 47.92,41.05 J5.2 | 47.03,41.05 47.03,42.29 45.25,44.07 43.47,44.07 U4.18 | IC2.4 18.23,86.74 18.23,87.63 17.69,88.17 17.69,88.7 18.58,89.59 21.96,89.59 23.91,87.63 L1.2 24.09,87.45 26.4,87.45 33.52,80.34 33.52,79.28 32.27,78.03 32.27,60.78 | JP3.4 51.83,53.85 51.83,58.12 53.43,59.72 53.43,61.14 53.07,61.5 50.76,61.5 49.16,59.9 49.16,59.01 R6.2 | R4.2 48.98,48.87 48.98,51.18 R5.2 48.98,51.36 47.21,53.14 46.85,53.14 46.32,53.67 | 29.43,56.34 29.43,58.83 R22.2 29.43,59.01 31.2,60.78 32.27,60.78 | 44.01,56.34 44.01,58.83 R20.2 43.83,59.01 42.94,59.9 41.16,59.9 40.81,59.54 37.96,59.54 36.72,60.78 32.27,60.78 | 46.32,53.67 44.01,55.98 44.01,56.34 | 44.01,56.34 R19.2 | 46.32,53.67 v46.32,53.14 | 29.43,56.34 v30.85,54.92 | 29.43,56.34 R21.2
  Bottom 0.203: 38.14,41.23 36.18,43.18 v36.18,44.25 34.58,45.85 v34.58,51.18 v30.85,54.92 | 38.14,41.23 47.92,41.23 J5.2 | 38.14,41.23 32.8,35.89 v32.8,33.76 32.8,23.45 J1.1 | v46.32,53.14 50.59,53.14 51.12,52.61 53.07,52.61 JP3.4
VCC_12V  (via drill 0.35)
  Top 0.203: 35.47,62.21 34.76,61.5 34.05,61.5 IC3.10 | 35.47,62.21 35.47,63.1 34.76,63.81 34.05,63.81 IC3.8 | 42.05,62.56 42.05,63.81 R17.1 | 42.05,62.56 42.05,61.5 R18.2 41.87,61.32 40.81,60.25 39.38,60.25 IC3.4 39.2,60.25 38.49,60.25 36.54,62.21 35.47,62.21 | v48.81,62.21 51.83,62.21 IC1.2 | 42.05,62.56 v40.98,62.56 39.38,62.56 IC3.6
  Bottom 0.203: v48.81,62.21 41.34,62.21 v40.98,62.56
VCC_24V  (via drill 0.35)
  Top 0.203: IC2.1 15.91,82.12 15.91,78.39 17.16,77.14 26.4,77.14 C11.1 26.58,77.14 v31.56,77.14 | v39.2,68.61 43.83,63.98 R17.2 | v37.6,58.83 39.2,58.83 IC3.3 | v45.96,59.9 45.96,60.07 46.67,60.78 IC1.8 | CON8.1 36.54,79.1 36.54,75.72 35.29,74.48 35.29,72.88 36.54,71.63 CON9.1
  Bottom 0.203: CON9.1 36.72,71.45 39.2,68.96 v39.2,68.61 37.6,67.01 37.6,59.9 | 37.6,59.9 v37.6,58.83 | 37.6,59.9 v45.96,59.9 | v31.56,77.14 34.58,77.14 CON8.1